# Altium schematic sheet 07_FPGA_HSIO_B2.SchDoc
size A3; DocumentNumber: 7; SheetNumber: 7; SheetTotal: 21
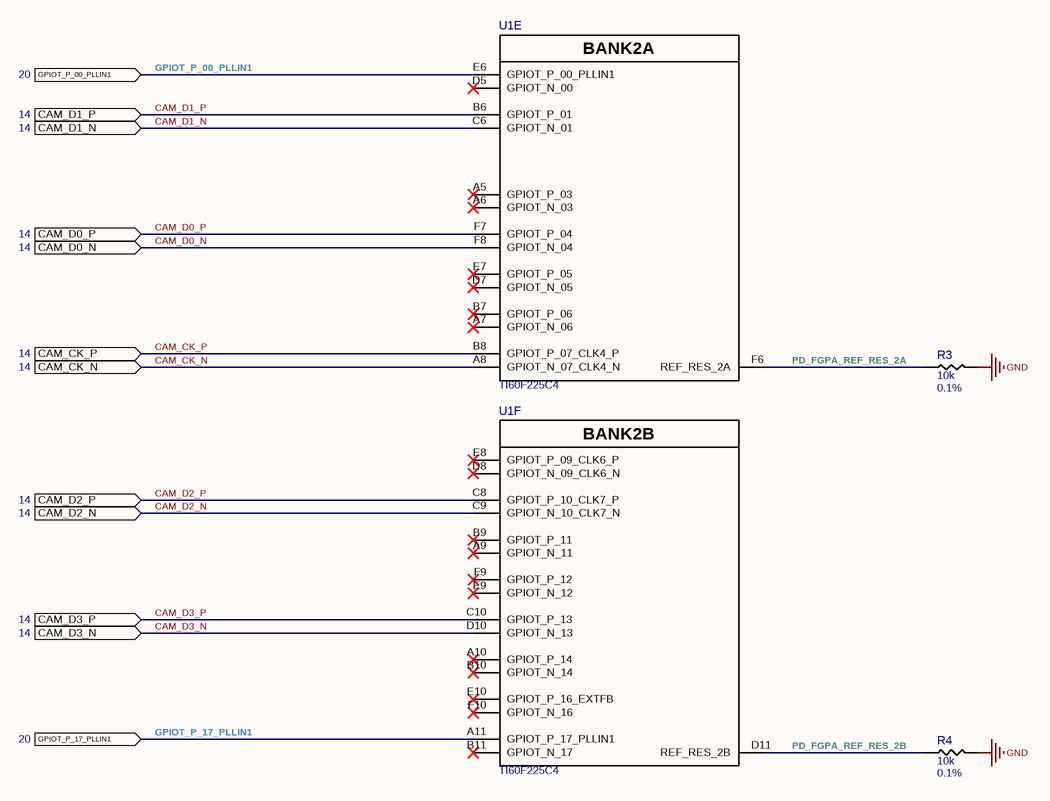
[diagram p0: 07_FPGA_HSIO_B2.SchDoc]

## Parts
R3  10k  Tol: 0.1%  [RESC1005X03N]
R4  10k  Tol: 0.1%  [RESC1005X03N]
U1  TI60F225C4  [BGA225C65P15X15_1000X1000X100]  (parts E,F of 13)

## Ports
CAM_CK_N (in, see 14), CAM_CK_P (in, see 14), CAM_D0_N (in, see 14), CAM_D0_P (in, see 14), CAM_D1_N (in, see 14), CAM_D1_P (in, see 14), CAM_D2_N (in, see 14), CAM_D2_P (in, see 14), CAM_D3_N (in, see 14), CAM_D3_P (in, see 14), GPIOT_P_00_PLLIN1 (in, see 20), GPIOT_P_17_PLLIN1 (in, see 20)

## Nets
GND: R3.2 R4.2
CAM_CK_N: U1.A8(GPIOT_N_07_CLK4_N) ; port CAM_CK_N
CAM_CK_P: U1.B8(GPIOT_P_07_CLK4_P) ; port CAM_CK_P
CAM_D0_N: U1.F8(GPIOT_N_04) ; port CAM_D0_N
CAM_D0_P: U1.F7(GPIOT_P_04) ; port CAM_D0_P
CAM_D1_N: U1.C6(GPIOT_N_01) ; port CAM_D1_N
CAM_D1_P: U1.B6(GPIOT_P_01) ; port CAM_D1_P
CAM_D2_N: U1.C9(GPIOT_N_10_CLK7_N) ; port CAM_D2_N
CAM_D2_P: U1.C8(GPIOT_P_10_CLK7_P) ; port CAM_D2_P
CAM_D3_N: U1.D10(GPIOT_N_13) ; port CAM_D3_N
CAM_D3_P: U1.C10(GPIOT_P_13) ; port CAM_D3_P
GPIOT_P_00_PLLIN1: U1.E6(GPIOT_P_00_PLLIN1) ; port GPIOT_P_00_PLLIN1
GPIOT_P_17_PLLIN1: U1.A11(GPIOT_P_17_PLLIN1) ; port GPIOT_P_17_PLLIN1
PD_FGPA_REF_RES_2A: R3.1 U1.F6(REF_RES_2A)
PD_FGPA_REF_RES_2B: R4.1 U1.D11(REF_RES_2B)

Not connected (* = marked no-connect by the designer): U1 A5(GPIOT_P_03)* A6(GPIOT_N_03)* A7(GPIOT_N_06)* A9(GPIOT_N_11)* A10(GPIOT_P_14)* B7(GPIOT_P_06)* B9(GPIOT_P_11)* B10(GPIOT_N_14)* B11(GPIOT_N_17)* D5(GPIOT_N_00)* D7(GPIOT_N_05)* D8(GPIOT_N_09_CLK6_N)* E7(GPIOT_P_05)* E8(GPIOT_P_09_CLK6_P)* E9(GPIOT_N_12)* E10(GPIOT_P_16_EXTFB)* F9(GPIOT_P_12)* F10(GPIOT_N_16)*

## Notes on the sheet
- (in symbol TI60F225C4, part E) BANK2A
- (in symbol TI60F225C4, part F) BANK2B

## Library data of the parts
R3 R4 = RT0402BRD0710KL: RES SMD 10K OHM 0.1% 1/16W 0402; Manufacturer 1: Yageo; Part Number: RT0402BRD0710KL; Value: 10k; Manufacturer Part Number 1: RT0402BRD0710KL; Supplier 1: Digi-Key; Supplier Part Number 1: YAG1346CT-ND
U1 = TI60F225C4: FPGA TITAN 140HSIO 4PLL 225BGA; Manufacturer 1: Efinix, Inc.; Part Number: TI60F225C4; Manufacturer Part Number 1: TI60F225C4; Supplier 1: Digi-Key; Supplier Part Number 1: 2134-TI60F225C4-ND